# Altium schematic sheet [9]-CAMERA_POWER_CONTROLLER.SchDoc
size A4
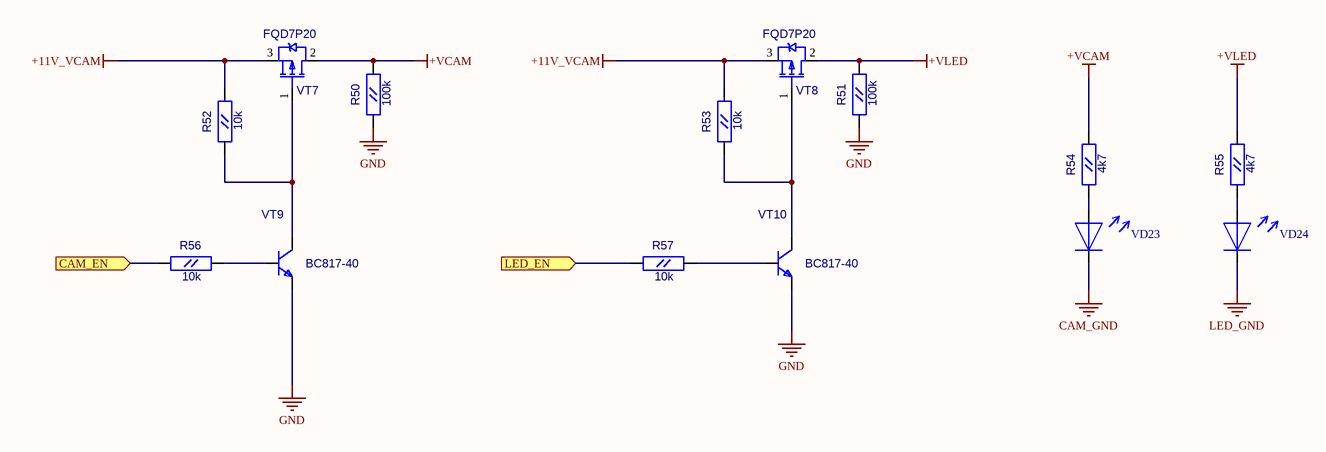
[diagram p0: [9]-CAMERA_POWER_CONTROLLER.SchDoc]

## Parts
R50  100k  [RC0603]
R51  100k  [RC0603]
R52  10k  [RC0603]
R53  10k  [RC0603]
R54  4k7  [RC0603]
R55  4k7  [RC0603]
R56  10k  [RC0603]
R57  10k  [RC0603]
VD23  LED_0805  [LED0805]  (value not drawn)
VD24  LED_0805  [LED0805]  (value not drawn)
VT7  FQD7P20  [D-PAK(TO-252AA)]
VT8  FQD7P20  [D-PAK(TO-252AA)]
VT9  BC817-40  [SOT-23(123)]
VT10  BC817-40  [SOT-23(123)]

## Ports
CAM_EN (in), LED_EN (in)

## Nets
+11V_VCAM: R52.2(B) R53.2(B) VT7.3(S) VT8.3(S)
+VCAM: R50.2(B) R54.2(B) VT7.2(D)
+VLED: R51.2(B) R55.2(B) VT8.2(D)
CAM_GND: VD23.2
GND: R50.1(A) R51.1(A) VT9.2(E) VT10.2(E)
LED_GND: VD24.2
CAM_EN: R56.1(A) ; port CAM_EN
LED_EN: R57.1(A) ; port LED_EN
NetR52_1: R52.1(A) VT7.1(G) VT9.3(C)
NetR53_1: R53.1(A) VT8.1(G) VT10.3(C)
NetR54_1: R54.1(A) VD23.1
NetR55_1: R55.1(A) VD24.1
NetR56_2: R56.2(B) VT9.1(B)
NetR57_2: R57.2(B) VT10.1(B)

## Library data of the parts
R50-R57 = RC0603
  R50 R51: Value: 100k
  R52 R53 R56 R57: Value: 10k
  R54 R55: Value: 4k7
VT7 VT8 = IRFR9220: HEXFET Power MOSFET; OriginalName: IRLML5103; ComponentField7: Published 8-Jun-2000; Value: FQD7P20
VT9 VT10 = BC846BLT1: NPN 500ma transistor; ComponentField7: Published 29-Sep-2000; OriginalName: BC846BLT1; Value: BC817-40
VD23 VD24 = LED_0805: Value: LED_0805